# EAGLE design HUDvio (EAGLE 9.6.2)

## Sheet 1 of 3: Primary Sheet
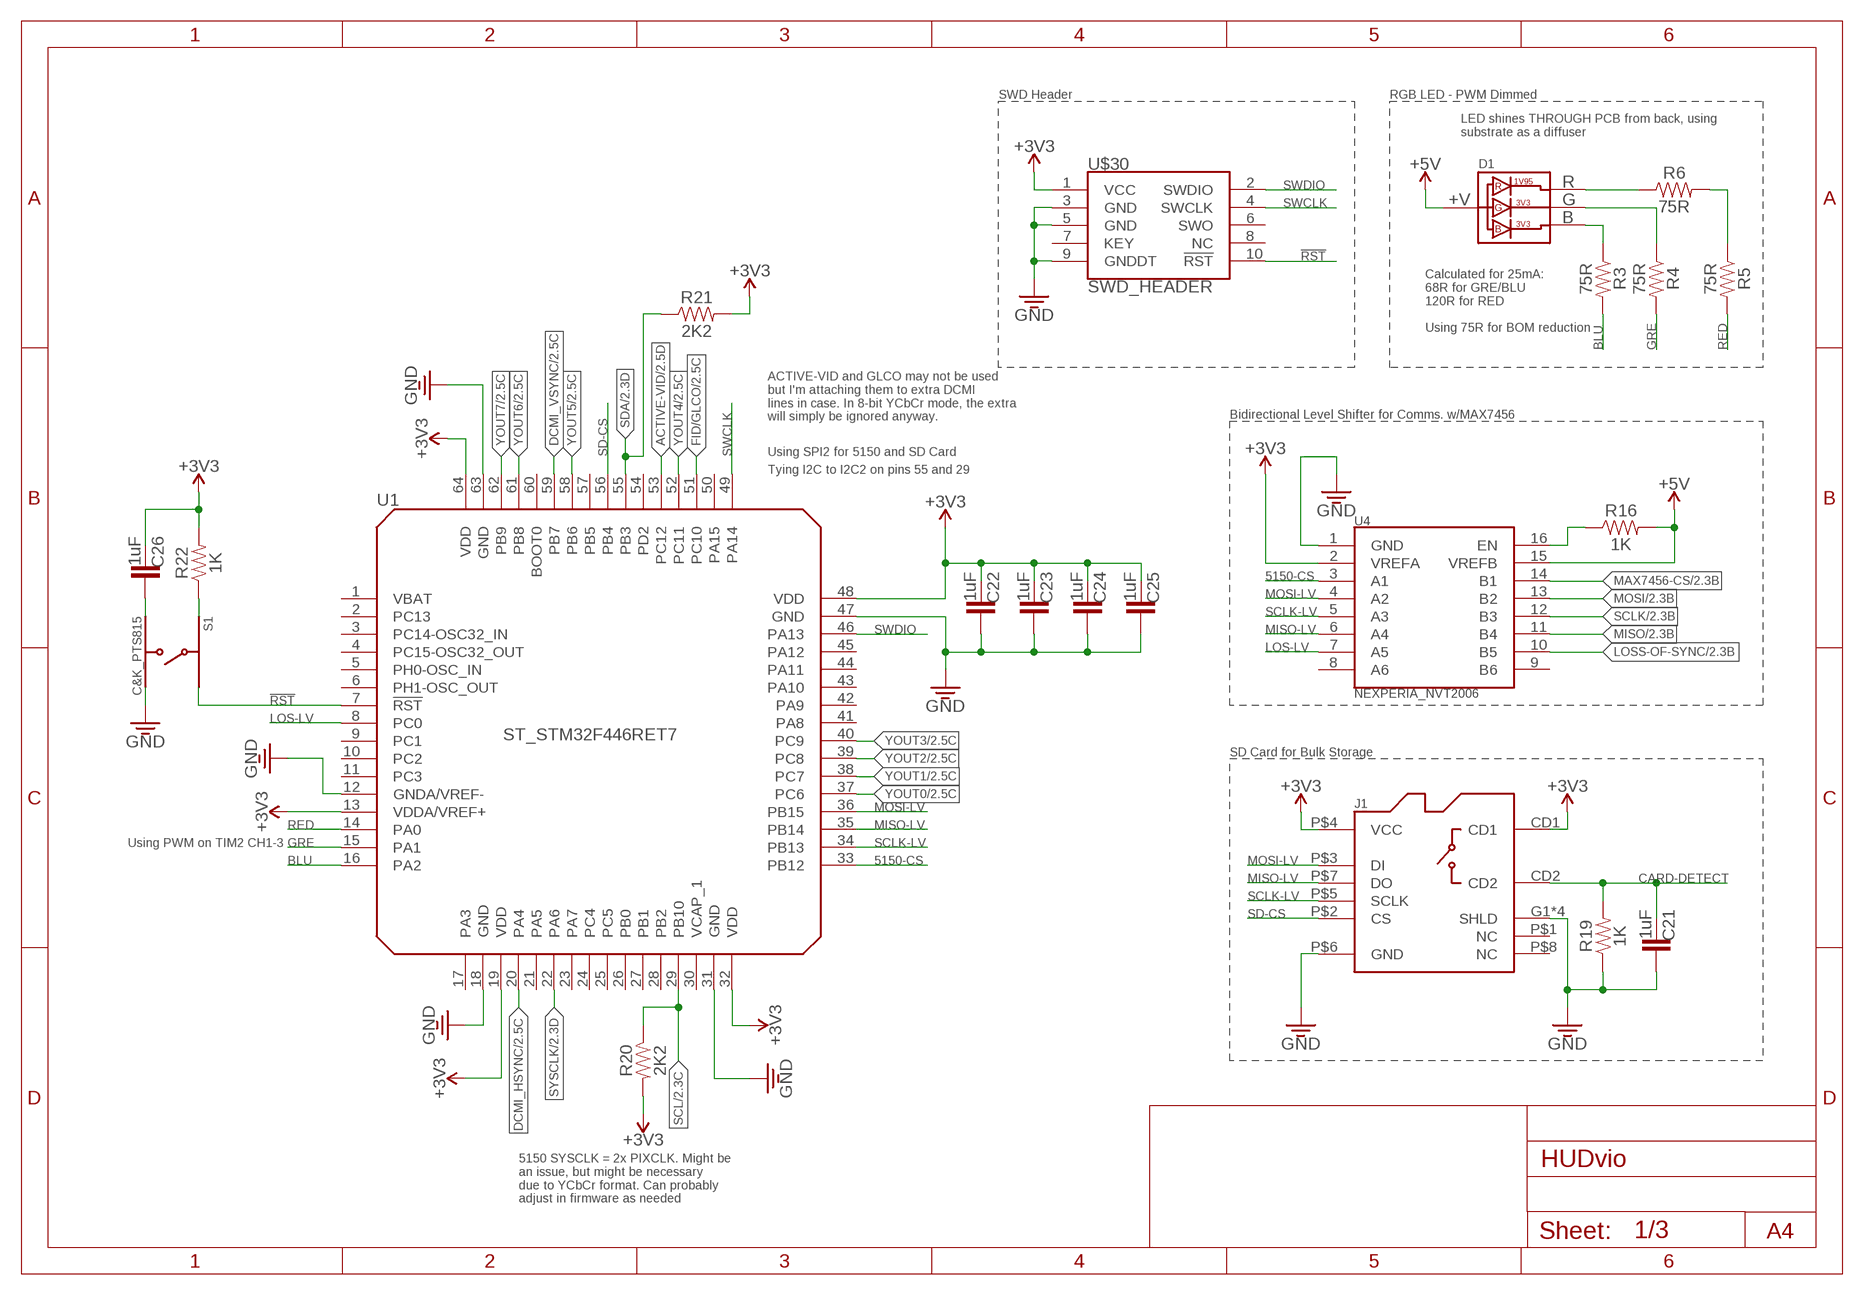
[diagram p0: schematic, sheet 1]

### Parts
C21  1UF_0805  [KEMET_0805]
C22  1UF_0805  [KEMET_0805]
C23  1UF_0805  [KEMET_0805]
C24  1UF_0805  [KEMET_0805]
C25  1UF_0805  [KEMET_0805]
C26  1UF_0805  [KEMET_0805]
D1  SUNLED_XZMDKCBDDG45S-9  [SUNLED_XZXXXXXX45S-9]
J1  MOLEX_1040310811  [MOLEX_1040310811]
R3  75R_0603  [0603]
R4  75R_0603  [0603]
R5  75R_0603  [0603]
R6  75R_0603  [0603]
R16  1K_0603  [0603]
R19  1K_0603  [0603]
R20  2K2_0603  [0603]
R21  2K2_0603  [0603]
R22  1K_0603  [0603]
S1  C&K_PTS815  [C&K_PTS815]
U1  ST_STM32F446RET7  [ST_LQFP64]
U4  NEXPERIA_NVT2006  [NEXPERIA_SOT403-1_(TSSOP16)]
U$30  SWD_HEADER  [CNC_3220-10-0300-00]

### Nets
5150-CS: U1.33(PB12) U4.3(A1)
!RST: S1.2 U1.7(!RST!) U$30.10(!RST!)
+3V3: C22.P$1 C23.P$1 C24.P$1 C25.P$1 C26.P$1 J1.CD1 J1.P$4(VCC) R20.2 R21.2 R22.2 U1.13(VDDA/VREF+) U1.19(VDD) U1.32(VDD) U1.48(VDD) U1.64(VDD) U4.2(VREFA) U$30.1(VCC) ; also sheet 2,3
+5V: D1.P$2(VCC) R16.2 U4.15(VREFB) ; also sheet 2,3
ACTIVE-VID: U1.53(PC12) ; also sheet 2
BLU: R3.2 U1.16(PA2)
CARD-DETECT: C21.P$1 J1.CD2 R19.2
DCMI_HSYNC: U1.20(PA4) ; also sheet 2
DCMI_VSYNC: U1.59(PB7) ; also sheet 2
FID/GLCO: U1.51(PC10) ; also sheet 2
GND: C21.P$2 C22.P$2 C23.P$2 C24.P$2 C25.P$2 J1.G1(SHLD) J1.G2(SHLD) J1.G3(SHLD) J1.G4(SHLD) J1.P$6(GND) R19.1 S1.4 U1.12(GNDA/VREF-) U1.18(GND) U1.31(GND) U1.47(GND) U1.63(GND) U4.1(GND) U$30.3(GND) U$30.5(GND) U$30.9(GNDDT) ; also sheet 2,3
GRE: R4.2 U1.15(PA1)
LOS-LV: U1.8(PC0) U4.7(A5)
LOSS-OF-SYNC: U4.10(B5) ; also sheet 2
MAX7456-CS: U4.14(B1) ; also sheet 2
MISO: U4.11(B4) ; also sheet 2
MISO-LV: J1.P$7(DO) U1.35(PB14) U4.6(A4)
MOSI: U4.13(B2) ; also sheet 2
MOSI-LV: J1.P$3(DI) U1.36(PB15) U4.4(A2)
N$2: D1.P$1(R) R6.1
N$3: R5.1 R6.2
N$4: D1.P$4(G) R4.1
N$5: D1.P$3(B) R3.1
N$13: R16.1 U4.16(EN)
N$17: R22.1 S1.1
N$18: C26.P$2 S1.3
RED: R5.2 U1.14(PA0)
SCL: R20.1 U1.29(PB10) ; also sheet 2
SCLK: U4.12(B3) ; also sheet 2
SCLK-LV: J1.P$5(SCLK) U1.34(PB13) U4.5(A3)
SD-CS: J1.P$2(CS) U1.56(PB4)
SDA: R21.1 U1.55(PB3) ; also sheet 2
SWCLK: U1.49(PA14) U$30.4(SWCLK)
SWDIO: U1.46(PA13) U$30.2(SWDIO)
SYSCLK: U1.22(PA6) ; also sheet 2
YOUT0: U1.37(PC6) ; also sheet 2
YOUT1: U1.38(PC7) ; also sheet 2
YOUT2: U1.39(PC8) ; also sheet 2
YOUT3: U1.40(PC9) ; also sheet 2
YOUT4: U1.52(PC11) ; also sheet 2
YOUT5: U1.58(PB6) ; also sheet 2
YOUT6: U1.61(PB8) ; also sheet 2
YOUT7: U1.62(PB9) ; also sheet 2
Unconnected: J1.P$1(NC) J1.P$8(NC) U1.2(PC13) U1.3(PC14-OSC32_IN) U1.4(PC15-OSC32_OUT) U1.5(PH0-OSC_IN) U1.6(PH1-OSC_OUT) U1.9(PC1) U1.10(PC2) U1.11(PC3) U1.17(PA3) U1.21(PA5) U1.23(PA7) U1.24(PC4) U1.25(PC5) U1.26(PB0) U1.27(PB1) U1.28(PB2) U1.41(PA8) U1.42(PA9) U1.43(PA10) U1.44(PA11) U1.45(PA12) U1.50(PA15) U1.54(PD2) U1.57(PB5) U1.60(BOOT0) U4.8(A6) U4.9(B6) U$30.6(SWO) U$30.7(KEY) U$30.8(NC)

### Notes on the sheet
- SWD Header | RGB LED - PWM Dimmed
- LED shines THROUGH PCB from back, using
  substrate as a diffuser
- Calculated for 25mA:
  68R for GRE/BLU
  120R for RED
  
  Using 75R for BOM reduction
- Bidirectional Level Shifter for Comms. w/MAX7456
- ACTIVE-VID and GLCO may not be used
  but I'm attaching them to extra DCMI
  lines in case. In 8-bit YCbCr mode, the extra
  will simply be ignored anyway.
- Using SPI2 for 5150 and SD Card
- Tying I2C to I2C2 on pins 55 and 29
- SD Card for Bulk Storage
- Using PWM on TIM2 CH1-3
- 5150 SYSCLK = 2x PIXCLK. Might be
  an issue, but might be necessary
  due to YCbCr format. Can probably 
  adjust in firmware as needed

## Sheet 2 of 3: Video Processing
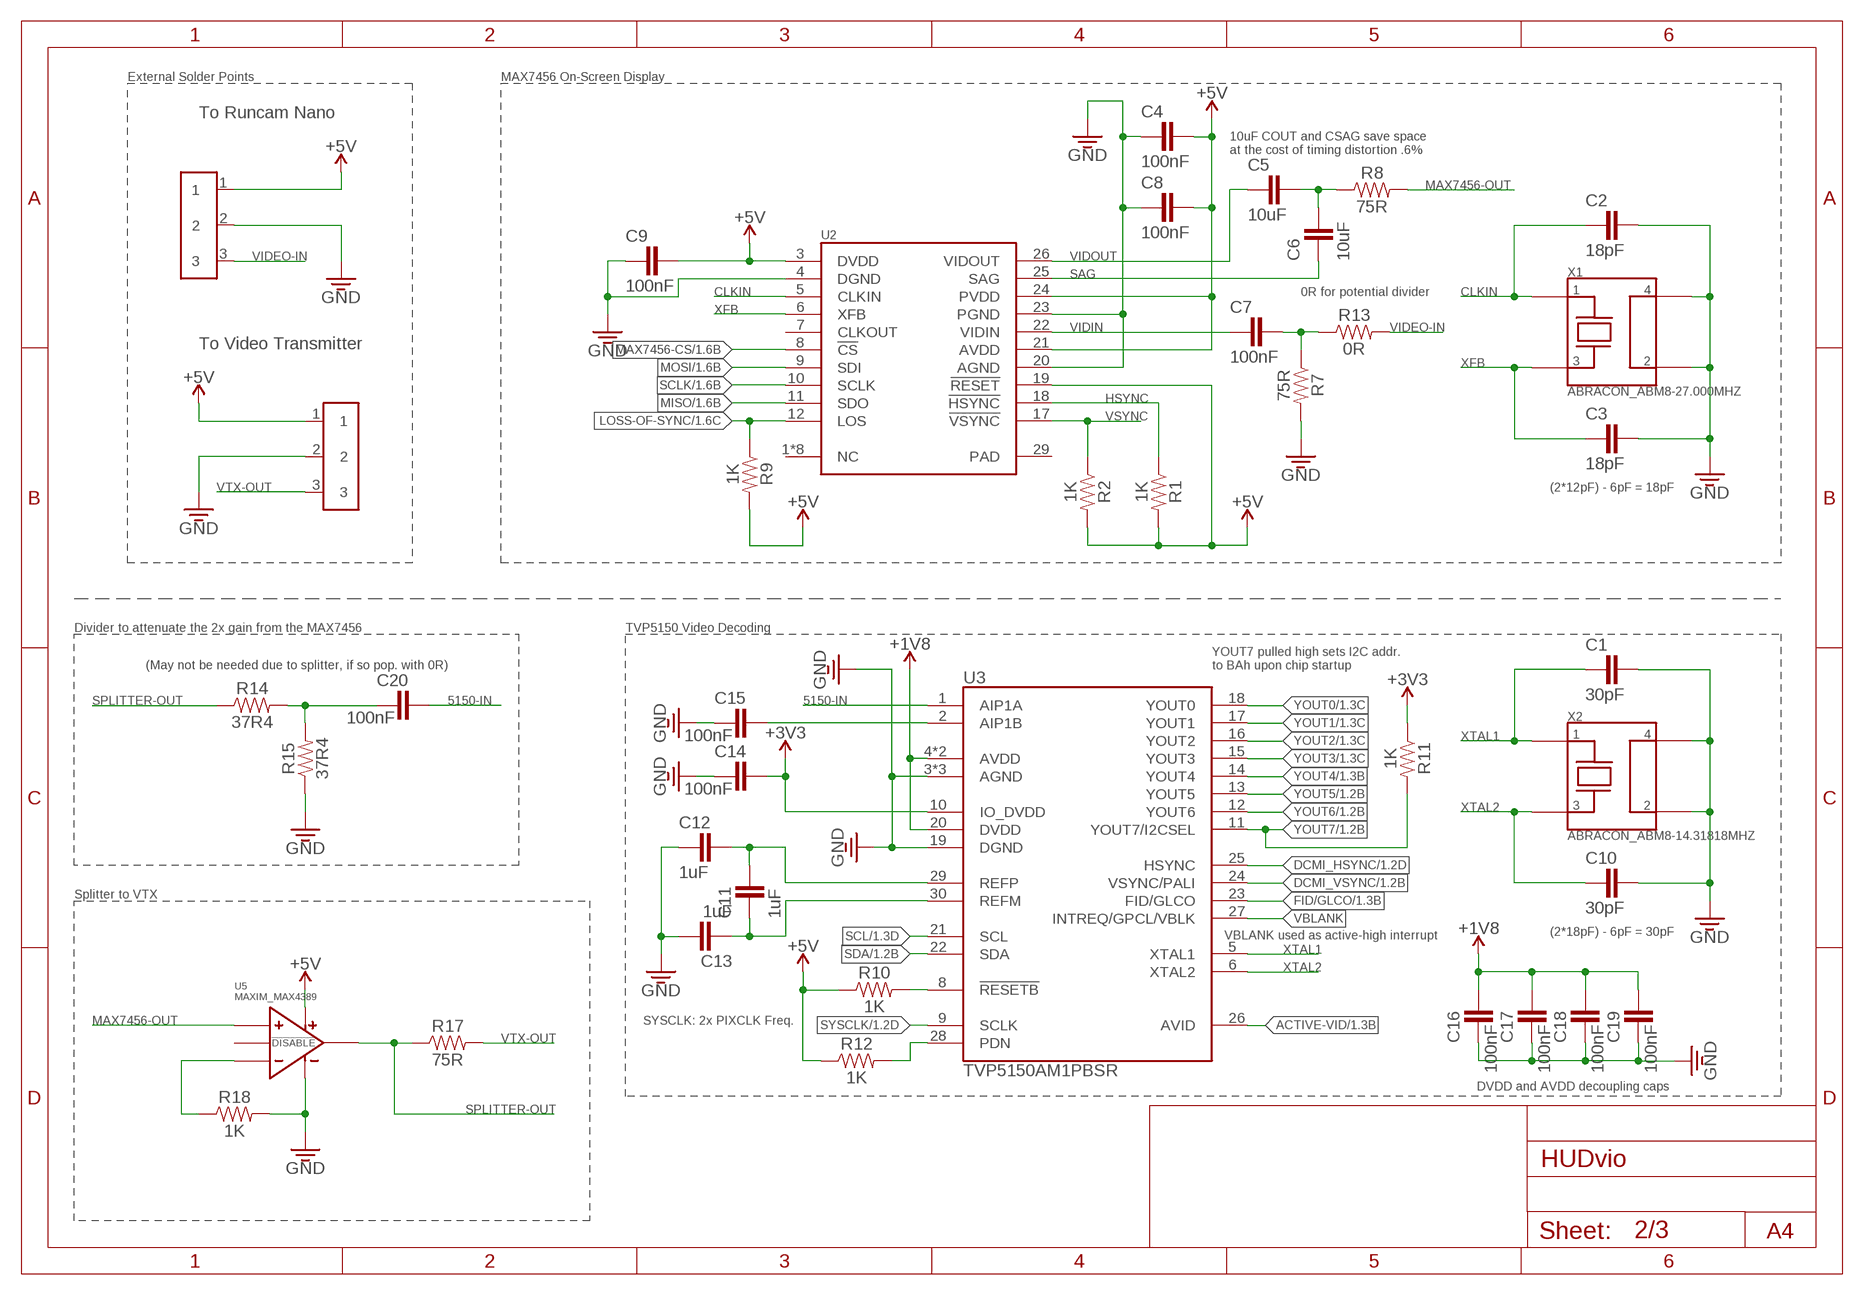
[diagram p1: schematic, sheet 2]

### Parts
C1  30PF_0805  [KEMET_0805]
C2  18PF_0805  [KEMET_0805]
C3  18PF_0805  [KEMET_0805]
C4  100NF_0805  [KEMET_0805]
C5  10UF_0805  [KEMET_0805]
C6  10UF_0805  [KEMET_0805]
C7  100NF_0805  [KEMET_0805]
C8  100NF_0805  [KEMET_0805]
C9  100NF_0805  [KEMET_0805]
C10  30PF_0805  [KEMET_0805]
C11  1UF_0805  [KEMET_0805]
C12  1UF_0805  [KEMET_0805]
C13  1UF_0805  [KEMET_0805]
C14  100NF_0805  [KEMET_0805]
C15  100NF_0805  [KEMET_0805]
C16  100NF_0805  [KEMET_0805]
C17  100NF_0805  [KEMET_0805]
C18  100NF_0805  [KEMET_0805]
C19  100NF_0805  [KEMET_0805]
C20  100NF_0805  [KEMET_0805]
R1  1K_0603  [0603]
R2  1K_0603  [0603]
R7  75R_0603  [0603]
R8  75R_0603  [0603]
R9  1K_0603  [0603]
R10  1K_0603  [0603]
R11  1K_0603  [0603]
R12  1K_0603  [0603]
R13  0R_0603  [0603]
R14  37R4_0603  [0603]
R15  37R4_0603  [0603]
R17  75R_0603  [0603]
R18  1K_0603  [0603]
U2  MAXIM_MAX7456  [MAXIM_MAX7456EUI+T]
U3  TVP5150AM1PBSR  [TI_PBS_(S-PQFP-G32)]
U5  MAXIM_MAX4389  [MAXIM_21-0058_(SOT23-6)]
U$1  SOLDER_PAD_1X3  [SOLDER_PAD_1X3_3X2MM]
U$3  SOLDER_PAD_1X3  [SOLDER_PAD_1X3_3X2MM]
X1  ABRACON_ABM8-27.000MHZ  [ABRACON_ABM8]
X2  ABRACON_ABM8-14.31818MHZ  [ABRACON_ABM8]

### Nets
5150-IN [75R]: C20.P$2 U3.1(AIP1A)
$NET11 [75R]: C7.P$2 R7.1 R13.1
+1V8: C16.P$2 C17.P$2 C18.P$2 C19.P$2 U3.4(AVDD) U3.20(DVDD) U3.32(AVDD) ; also sheet 3
+3V3: C14.P$2 R11.1 U3.10(IO_DVDD) ; also sheet 1,3
+5V: C4.P$2 C8.P$2 C9.P$2 R9.2 R10.1 R12.1 U2.3(DVDD) U2.21(AVDD) U2.24(PVDD) U5.6(VCC) U$1.1 U$3.1 ; also sheet 1,3
ACTIVE-VID: U3.26(AVID) ; also sheet 1
CLKIN: C2.P$1 U2.5(CLKIN) X1.1
DCMI_HSYNC: U3.25(HSYNC) ; also sheet 1
DCMI_VSYNC: U3.24(VSYNC/PALI) ; also sheet 1
FID/GLCO: U3.23(FID/GLCO) ; also sheet 1
GND: C1.P$2 C2.P$2 C3.P$2 C4.P$1 C8.P$1 C9.P$1 C10.P$2 C12.P$1 C13.P$2 C14.P$1 C15.P$1 C16.P$1 C17.P$1 C18.P$1 C19.P$1 R7.2 R15.1 R18.2 U2.4(DGND) U2.20(AGND) U2.23(PGND) U3.3(AGND) U3.7(AGND) U3.19(DGND) U3.31(AGND) U5.2(VEE) U$1.2 U$3.2 X1.2 X1.4 X2.2 X2.4 ; also sheet 1,3
HSYNC: R1.1 U2.18(!HSYNC!)
LOSS-OF-SYNC: R9.1 U2.12(LOS) ; also sheet 1
MAX7456-CS: U2.8(!CS!) ; also sheet 1
MAX7456-OUT [75R]: R8.2
MISO: U2.11(SDO) ; also sheet 1
MOSI: U2.9(SDI) ; also sheet 1
N$1: R1.2 R2.2 U2.19(!RESET!) ; supply symbol labelled +5V
N$6: R10.2 U3.8(!RESETB!)
N$7: R12.2 U3.28(PDN)
N$8: C11.P$1 C13.P$1 U3.30(REFM)
N$9: C11.P$2 C12.P$2 U3.29(REFP)
N$10: C5.P$2 C6.P$2 R8.1
N$11: C20.P$1 R14.2 R15.2
N$12: C15.P$2 U3.2(AIP1B)
N$14: U5.3(IN+)
N$15: R18.1 U5.4(IN-)
SAG: C6.P$1 U2.25(SAG)
SCL: U3.21(SCL) ; also sheet 1
SCLK: U2.10(SCLK) ; also sheet 1
SDA: U3.22(SDA) ; also sheet 1
SPLITTER-OUT [75R]: R14.1 R17.1 U5.1(OUT)
SYSCLK: U3.9(SCLK) ; also sheet 1
VBLANK: U3.27(INTREQ/GPCL/VBLK)
VIDEO-IN [75R]: R13.2 U$1.3
VIDIN [75R]: C7.P$1 U2.22(VIDIN)
VIDOUT [75R]: C5.P$1 U2.26(VIDOUT)
VSYNC: R2.1 U2.17(!VSYNC!)
VTX-OUT [75R]: R17.2 U$3.3
XFB: C3.P$1 U2.6(XFB) X1.3
XTAL1: C1.P$1 U3.5(XTAL1) X2.1
XTAL2: C10.P$1 U3.6(XTAL2) X2.3
YOUT0: U3.18(YOUT0) ; also sheet 1
YOUT1: U3.17(YOUT1) ; also sheet 1
YOUT2: U3.16(YOUT2) ; also sheet 1
YOUT3: U3.15(YOUT3) ; also sheet 1
YOUT4: U3.14(YOUT4) ; also sheet 1
YOUT5: U3.13(YOUT5) ; also sheet 1
YOUT6: U3.12(YOUT6) ; also sheet 1
YOUT7: R11.2 U3.11(YOUT7/I2CSEL) ; also sheet 1
Unconnected: U2.1(NC) U2.2(NC) U2.7(CLKOUT) U2.13(NC) U2.14(NC) U2.15(NC) U2.16(NC) U2.27(NC) U2.28(NC) U5.5(!DISABLE!)

### Notes on the sheet
- External Solder Points | MAX7456 On-Screen Display
- To Runcam Nano
- 10uF COUT and CSAG save space
  at the cost of timing distortion .6%
- 0R for potential divider
- To Video Transmitter
- (2*12pF) - 6pF = 18pF
- Divider to attenuate the 2x gain from the MAX7456 | TVP5150 Video Decoding
- (May not be needed due to splitter, if so pop. with 0R)
- YOUT7 pulled high sets I2C addr. 
  to BAh upon chip startup
- Splitter to VTX
- VBLANK used as active-high interrupt | (2*18pF) - 6pF = 30pF
- SYSCLK: 2x PIXCLK Freq.
- DVDD and AVDD decoupling caps

## Sheet 3 of 3: Power Regulation
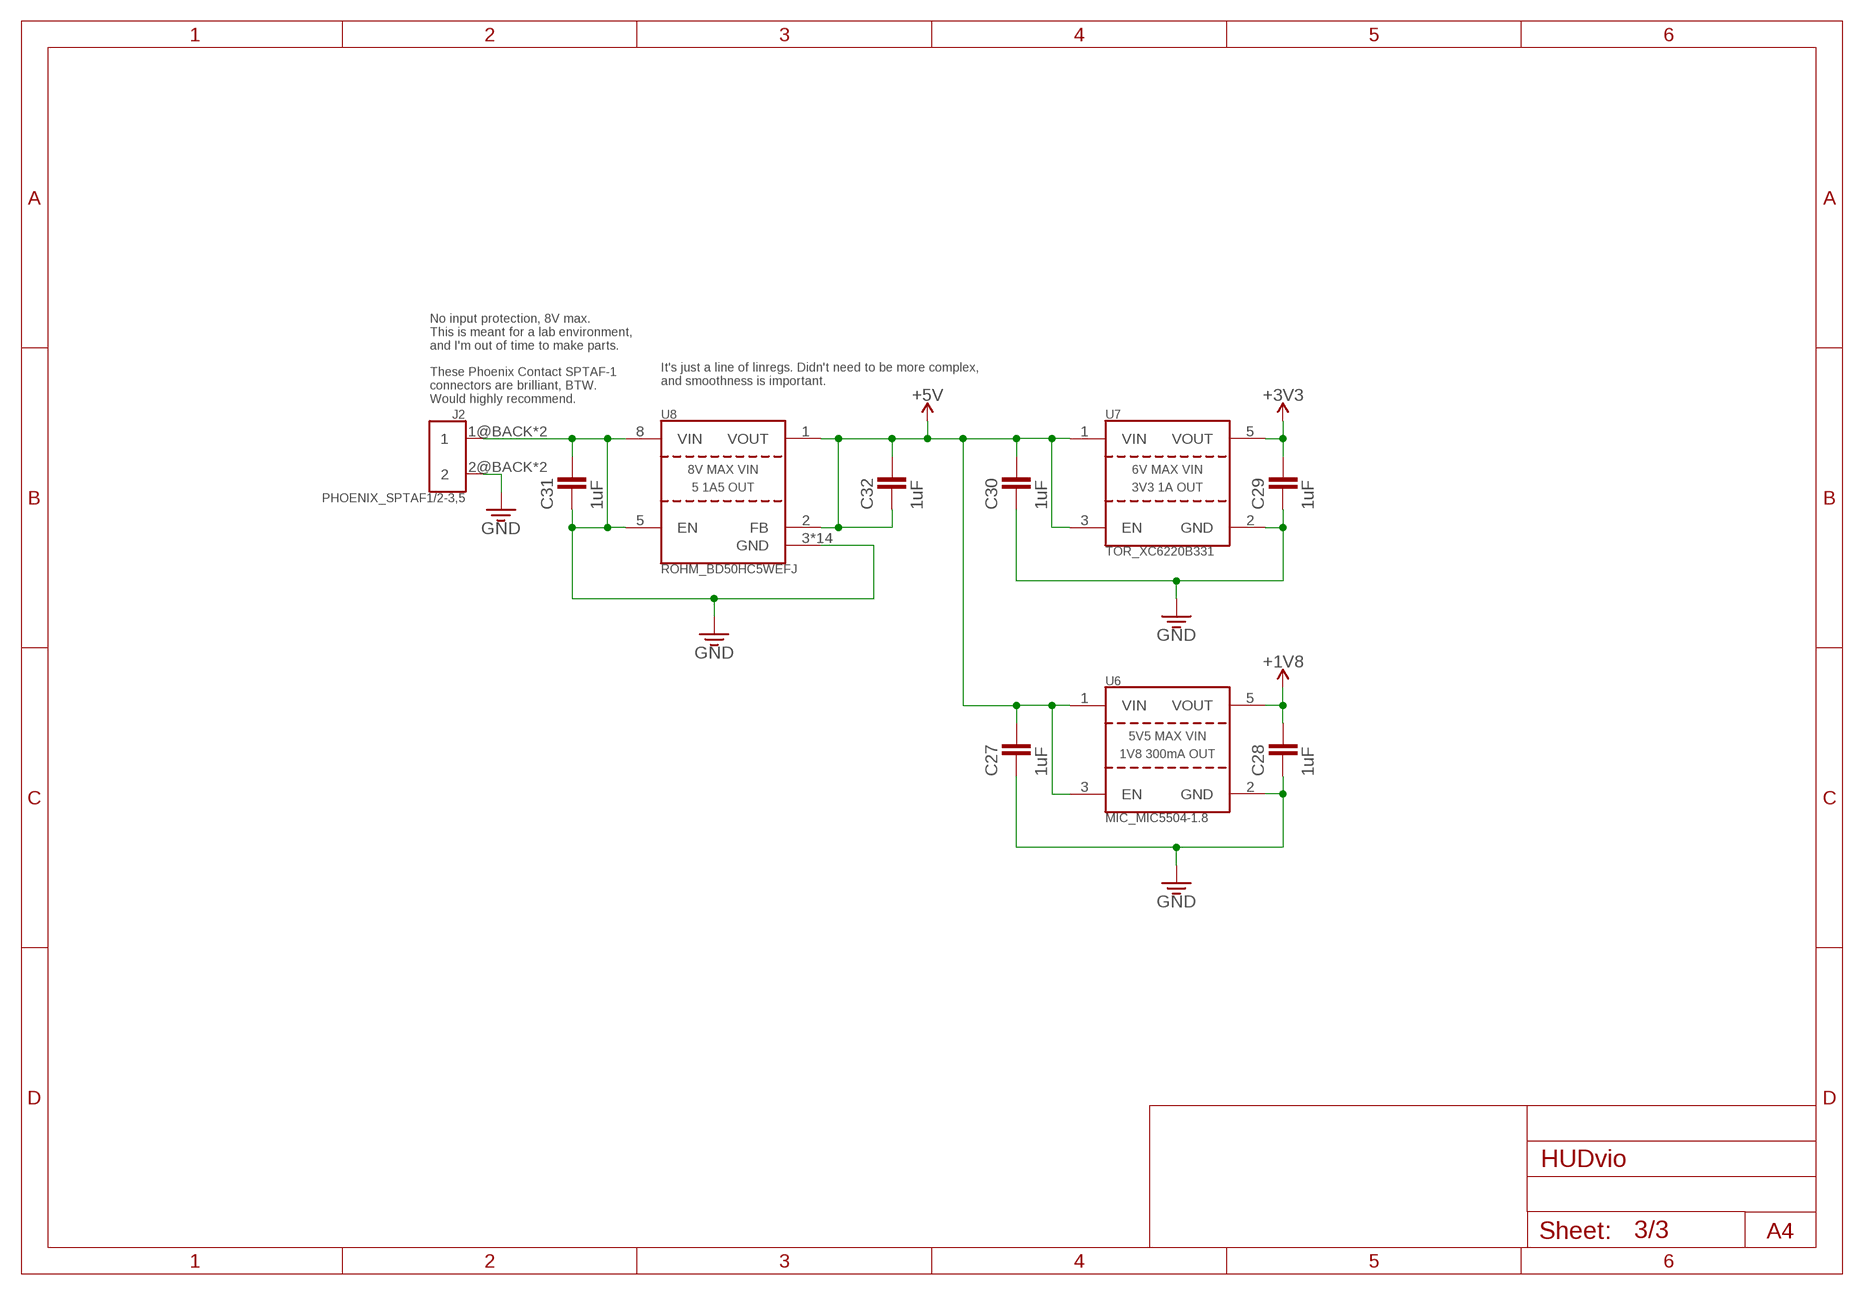
[diagram p2: schematic, sheet 3]

### Parts
C27  1UF_0805  [KEMET_0805]
C28  1UF_0805  [KEMET_0805]
C29  1UF_0805  [KEMET_0805]
C30  1UF_0805  [KEMET_0805]
C31  1UF_0805  [KEMET_0805]
C32  1UF_0805  [KEMET_0805]
J2  PHOENIX_SPTAF1/2-3,5  [PHOENIX_SPTAF1/X-3,5]
U6  MIC_MIC5504-1.8  [MIC_SOT23-5LD-PL-1]
U7  TOR_XC6220B331  [TOR_SOT-25]
U8  ROHM_BD50HC5WEFJ  [ROHM_HTSOP-J8]

### Nets
+1V8: C28.P$2 U6.5(VOUT) ; also sheet 2
+3V3: C29.P$2 U7.5(VOUT) ; also sheet 1,2
+5V: C27.P$2 C30.P$2 C32.P$1 C32.P$2 U6.1(VIN) U6.3(EN) U7.1(VIN) U7.3(EN) U8.1(VOUT) U8.2(FB) ; also sheet 1,2
GND: C27.P$1 C28.P$1 C31.P$1 C31.P$2 J2.1@BACK J2.1@FRONT J2.2@BACK J2.2@FRONT U6.2(GND) U8.3(GND) U8.5(EN) U8.8(VIN) U8.FIN10(GND) U8.FIN11(GND) U8.FIN14(GND) U8.FIN20(GND) U8.FIN21(GND) U8.FIN22(GND) U8.FIN23(GND) U8.FIN24(GND) U8.FIN30(GND) U8.FIN31(GND) U8.FIN33(GND) U8.FIN34(GND) U8.FIN(GND) ; also sheet 1,2
N$19: C29.P$1 C30.P$1 U7.2(GND) ; supply symbol labelled GND

### Notes on the sheet
- No input protection, 8V max. 
  This is meant for a lab environment, 
  and I'm out of time to make parts.
- It's just a line of linregs. Didn't need to be more complex,
  and smoothness is important.
- These Phoenix Contact SPTAF-1
  connectors are brilliant, BTW.
  Would highly recommend.

## Power pins joined to a net without a drawn wire
PAD: U2.29(PAD)
VBAT: U1.1(VBAT)
VCAP_1: U1.30(VCAP_1)

## Library data of the parts
C1 C10 = Skyhawkson-Capacitors:30PF_0805; DKPN: 399-17443-1-ND; PACKAGE: 0805; RATING: 50V; TEMP: C0G; TOL: 10%; VAL: 30pF
C2 C3 = Skyhawkson-Capacitors:18PF_0805; DKPN: 399-8030-1-ND; PACKAGE: 0805; RATING: 50V; TEMP: C0G; TOL: 10%; VAL: 18pF
C4 C7-C9 C14-C20 = Skyhawkson-Capacitors:100NF_0805; DKPN: 399-17887-1-ND; PACKAGE: 0805; RATING: 50V; TEMP: X7R; TOL: 10%; VAL: 100nF
C5 C6 = Skyhawkson-Capacitors:10UF_0805; DKPN: 1276-1096-1-ND; PACKAGE: 0805; RATING: 16V; TEMP: X5R; TOL: 10%; VAL: 10uF
C11-C13 C21-C32 = Skyhawkson-Capacitors:1UF_0805; DKPN: 399-7409-1-ND; PACKAGE: 0805; RATING: 50V; TEMP: X7R; TOL: 10%; VAL: 1uF
D1 = Skyhawkson-LEDs and Optoelectronics:SUNLED_XZMDKCBDDG45S-9: RGB 4-SMD 3V3 30mA; DKPN: 1497-1257-1-ND
J1 = Skyhawkson-Connectors:MOLEX_1040310811; DKPN: WM6357CT-ND
J2 = Skyhawkson-Connectors:PHOENIX_SPTAF1/2-3,5; DKPN: 277-12124-ND
R1 R2 R9-R12 R16 R18 R19 R22 = Skyhawkson-Resistors:1K_0603: RES SMD 75 OHM 1% 1/10W 0603; DKPN: 311-1.00KHRCT-ND; PACKAGE: 0603; POWER: .1W; TOL: 1%; VAL: 1K
R3-R8 R17 = Skyhawkson-Resistors:75R_0603: RES SMD 75 OHM 1% 1/10W 0603; DKPN: 311-75.0HRCT-ND; PACKAGE: 0603; POWER: .1W; TOL: 1%; VAL: 75R
R13 = Skyhawkson-Resistors:0R_0603: RES SMD 75 OHM 1% 1/10W 0603; DKPN: 311-0.0GRCT-ND; PACKAGE: 0603; POWER: .1W; TOL: 1%; VAL: 0R
R14 R15 = Skyhawkson-Resistors:37R4_0603: RES SMD 75 OHM 1% 1/10W 0603; DKPN: 311-37.4HRCT-ND; PACKAGE: 0603; POWER: .1W; TOL: 1%; VAL: 37R4
R20 R21 = Skyhawkson-Resistors:2K2_0603: RES SMD 75 OHM 1% 1/10W 0603; DKPN: 311-2.2KGRCT-ND; PACKAGE: 0603; POWER: .1W; TOL: 5%; VAL: 2K2
S1 = Skyhawkson-Miscellaneous:C&K_PTS815
U1 = Skyhawkson-Microcontrollers and Processors:ST_STM32F446RET7: ARM® Cortex®-M4 STM32F4 Microcontroller IC 32-Bit 180MHz 512KB (512K x 8) FLASH 64-LQFP (10x10); DKPN: 497-16775-ND
U2 = Skyhawkson-ICs:MAXIM_MAX7456: Video - IC Serial, SPI NTSC, PAL 28-TSSOP-EP Package; DKPN: (N/A) MAX7456EUI+CT-ND
U3 = Skyhawkson-ICs:TVP5150AM1PBSR; DKPN: 296-17016-1-ND
U4 = Skyhawkson-ICs:NEXPERIA_NVT2006; DKPN: 568-5296-1-ND
U5 = Skyhawkson-RF:MAXIM_MAX4389; DKPN: MAX4389EUT+TCT-ND
U6 = Skyhawkson-Power:MIC_MIC5504-1.8; DKPN: 576-4879-1-ND
U7 = Skyhawkson-Power:TOR_XC6220B331; DKPN: 893-1133-1-ND
U8 = Skyhawkson-Power:ROHM_BD50HC5WEFJ; DKPN: BD50HC5WEFJ-E2CT-ND
U$1 U$3 = Skyhawkson-Connectors:SOLDER_PAD_1X3; DKPN: N/A
U$30 = Skyhawkson-Connectors:SWD_HEADER; DKPN: 1175-1629-ND
X1 = Skyhawkson-Miscellaneous:ABRACON_ABM8-27.000MHZ; DKPN: 535-14981-1-ND
X2 = Skyhawkson-Miscellaneous:ABRACON_ABM8-14.31818MHZ; DKPN: 535-9828-1-ND

## Net classes
1 75R: width 0.144 mm, clearance 0.3 mm

## Board
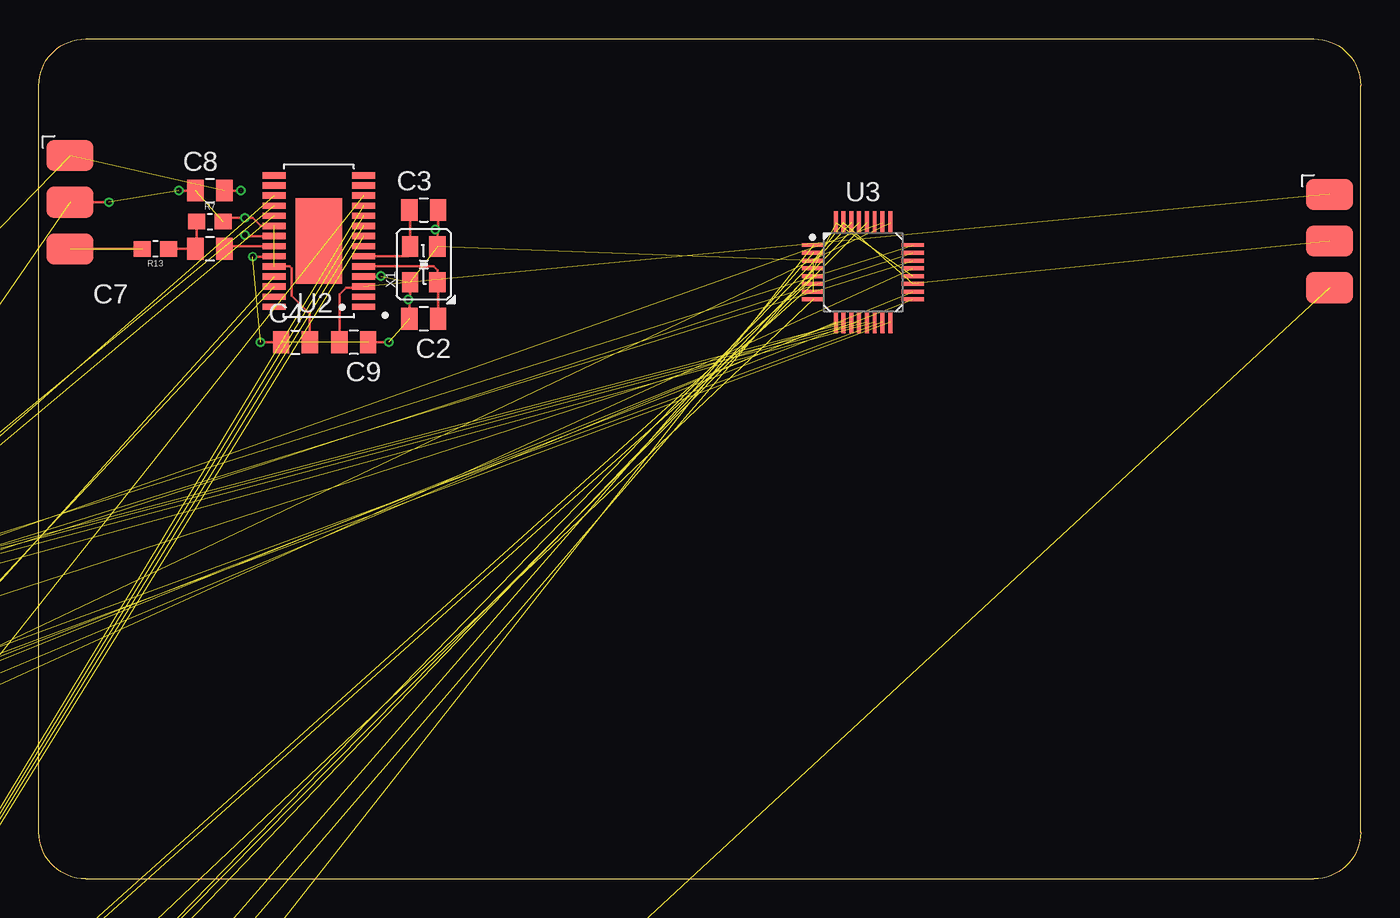
[diagram p3: board, top side]
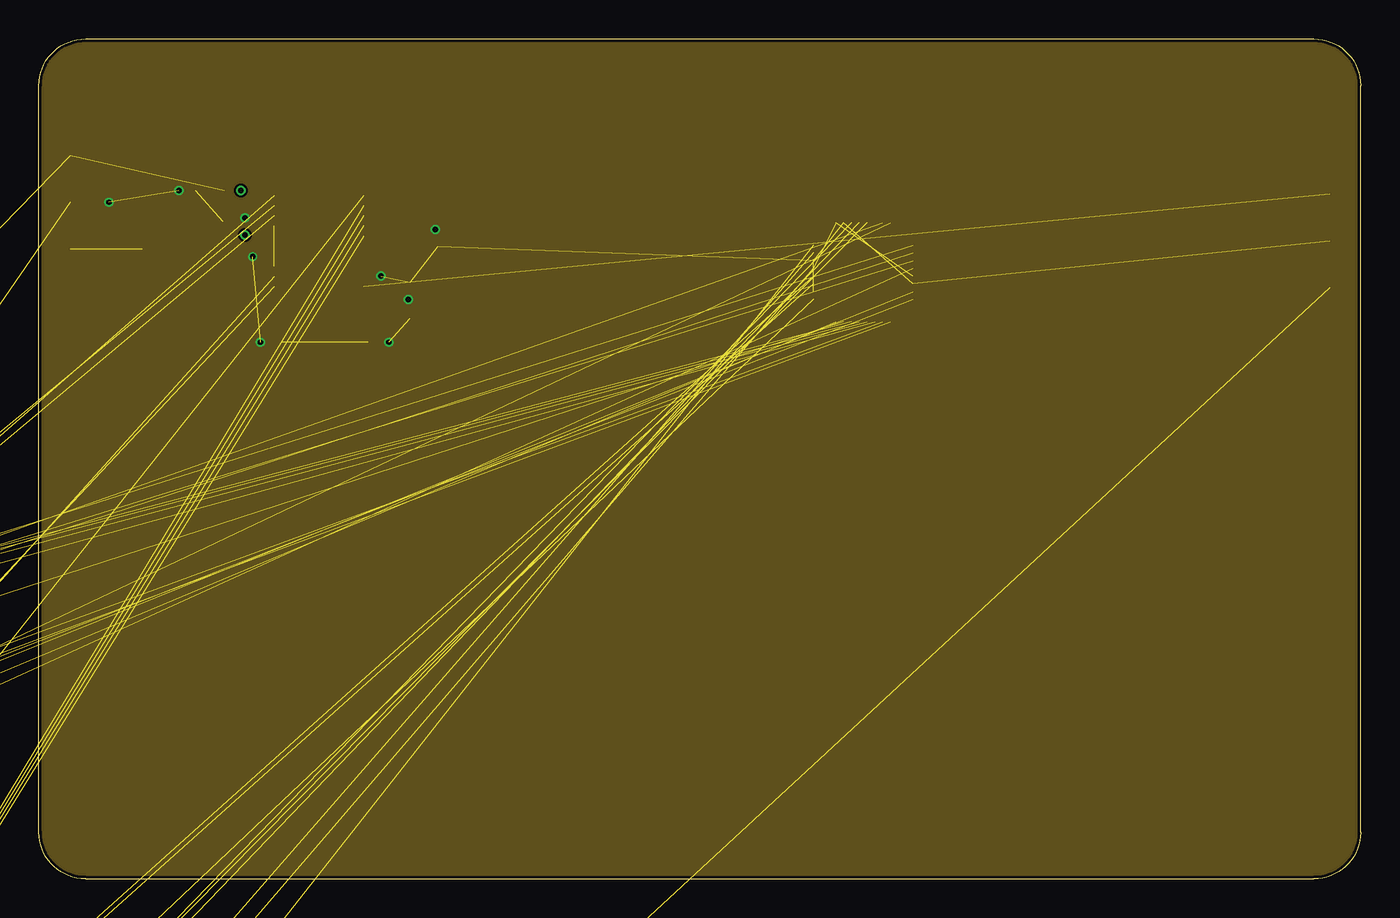
[diagram p4: board, inner layer Route2]
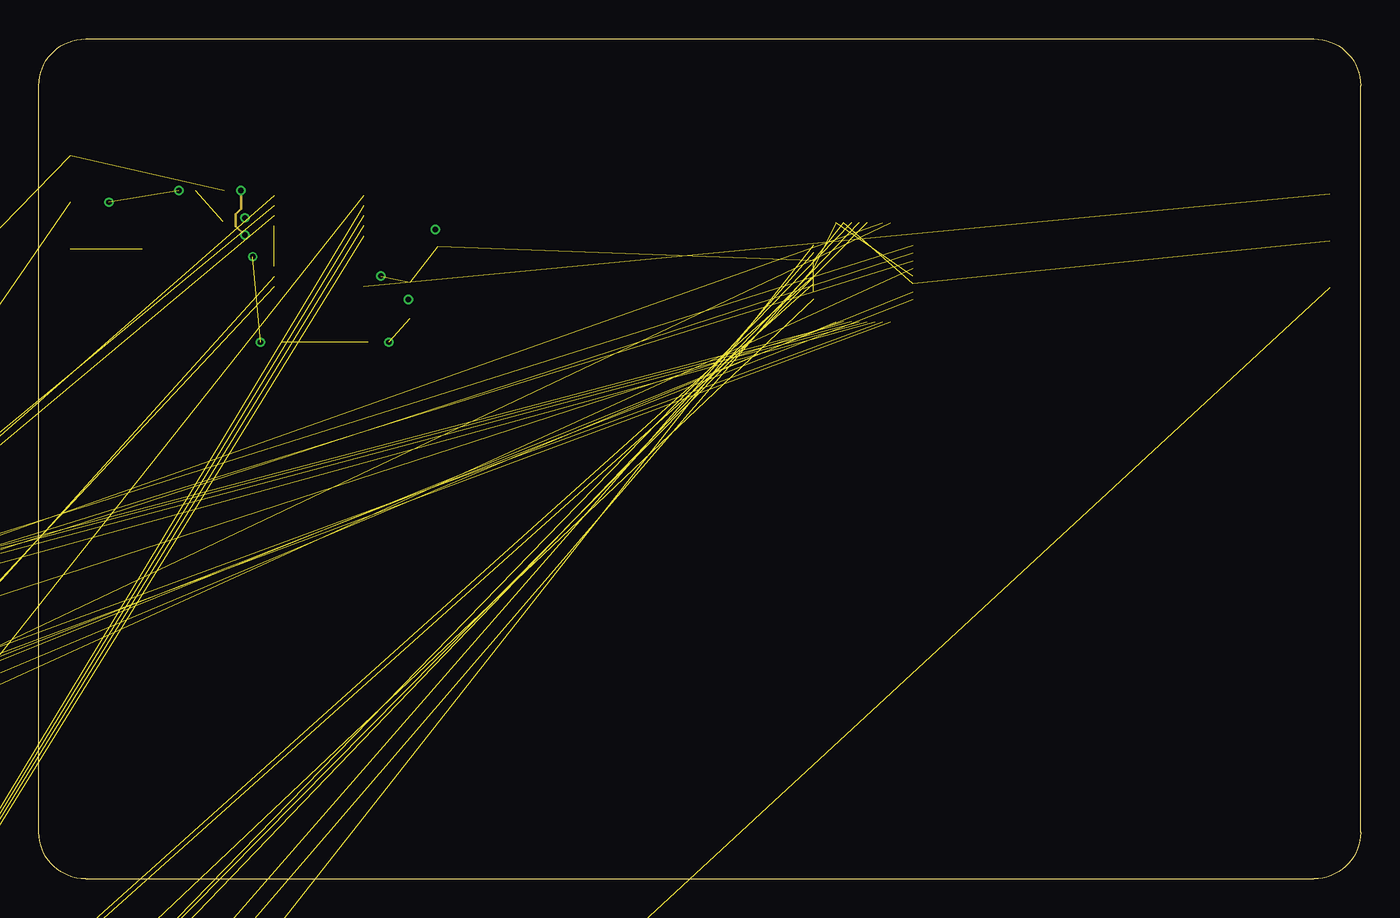
[diagram p5: board, inner layer Route15]

Size 85 x 54 mm. Coordinates in mm from the lower left corner, seen from the top.
Outline: 0,3 0,51 arc-90 3,54 82,54 arc-90 85,51 85,3 arc-90 82,0 3,0 arc-90 0,3
Copper layers (1+2*15+16): Top 0.035mm / dielectric 0.2mm / Route2 0.0175mm / dielectric 1.065mm / Route15 0.0175mm / dielectric 0.2mm / Bottom 0.035mm
Design rules "JLCPCB (4 Layer)": minimum track width 5mil, minimum drill 0.2mm, track to track 5mil, track to pad 5mil, pad to pad 5mil, via to via 20mil, smd to smd 5mil, copper to edge 0.2mm, drill to drill 21mil, minimum pad ring 6mil, minimum via ring 5mil, stop-mask expansion 2mil, vias tented up to drill 30mil, thermal gap 10mil

### Footprints (pad centres in the part's own frame; a part is rotated, then mirrored left to right if it is on the bottom)
KEMET_0805 = smd 1.05 x 1.4: P$1 -0.925,0; P$2 0.925,0
SUNLED_XZXXXXXX45S-9 = smd 1.4 x 0.8: P$1 2.6,0.8; P$2 -2.6,0.8; P$3 -2.6,-0.8; P$4 2.6,-0.8
MOLEX_1040310811 = smd 1.2 x 1: CD1 5.74,10.1; CD2 5.74,6.4 | smd 1.55 x 1.35: G1 5.565,0.425 | smd 0.9 x 1.8: G2 -5.755,0.65 | smd 1.9 x 1.35: G3 -3.73,11.075; G4 2.24,11.075 | smd 0.75 x 1.1: P$1 3.105,0.25; P$2 2.005,0.25; P$3 0.905,0.25; P$4 -0.195,0.25; P$5 -1.295,0.25; P$6 -2.395,0.25; P$7 -3.495,0.25; P$8 -4.595,0.25
PHOENIX_SPTAF1/X-3,5 = drill 1.1 pad 1.7: 1@BACK -1.75,2.5; 1@FRONT -1.75,-2.5; 2@BACK 1.75,2.5; 2@FRONT 1.75,-2.5
0603 = smd 1.1 x 1: 1 -0.85,0; 2 0.85,0
C&K_PTS815 = smd 1 x 0.7: 1 -2.25,1.075; 2 2.25,1.075; 3 -2.25,-1.075; 4 2.25,-1.075
ST_LQFP64 = smd 1.2 x 0.3: 1 -5.75,3.75; 2 -5.75,3.25; 3 -5.75,2.75; 4 -5.75,2.25; 5 -5.75,1.75; 6 -5.75,1.25; 7 -5.75,0.75; 8 -5.75,0.25; 9 -5.75,-0.25; 10 -5.75,-0.75; 11 -5.75,-1.25; 12 -5.75,-1.75; 13 -5.75,-2.25; 14 -5.75,-2.75; 15 -5.75,-3.25; 16 -5.75,-3.75; 33 5.75,-3.75; 34 5.75,-3.25; 35 5.75,-2.75; 36 5.75,-2.25; 37 5.75,-1.75; 38 5.75,-1.25; 39 5.75,-0.75; 40 5.75,-0.25; 41 5.75,0.25; 42 5.75,0.75; 43 5.75,1.25; 44 5.75,1.75; 45 5.75,2.25; 46 5.75,2.75; 47 5.75,3.25; 48 5.75,3.75 | smd 0.3 x 1.2: 17 -3.75,-5.75; 18 -3.25,-5.75; 19 -2.75,-5.75; 20 -2.25,-5.75; 21 -1.75,-5.75; 22 -1.25,-5.75; 23 -0.75,-5.75; 24 -0.25,-5.75; 25 0.25,-5.75; 26 0.75,-5.75; 27 1.25,-5.75; 28 1.75,-5.75; 29 2.25,-5.75; 30 2.75,-5.75; 31 3.25,-5.75; 32 3.75,-5.75; 49 3.75,5.75; 50 3.25,5.75; 51 2.75,5.75; 52 2.25,5.75; 53 1.75,5.75; 54 1.25,5.75; 55 0.75,5.75; 56 0.25,5.75; 57 -0.25,5.75; 58 -0.75,5.75; 59 -1.25,5.75; 60 -1.75,5.75; 61 -2.25,5.75; 62 -2.75,5.75; 63 -3.25,5.75; 64 -3.75,5.75
MAXIM_MAX7456EUI+T = smd 1.477 x 0.407: 1 -2.873,4.225; 2 -2.873,3.575; 3 -2.873,2.925; 4 -2.873,2.275; 5 -2.873,1.625; 6 -2.873,0.975; 7 -2.873,0.325; 8 -2.873,-0.325; 9 -2.873,-0.975; 10 -2.873,-1.625; 11 -2.873,-2.275; 12 -2.873,-2.925; 13 -2.873,-3.575; 14 -2.873,-4.225; 15 2.873,-4.225; 16 2.873,-3.575; 17 2.873,-2.925; 18 2.873,-2.275; 19 2.873,-1.625; 20 2.873,-0.975; 21 2.873,-0.325; 22 2.873,0.325; 23 2.873,0.975; 24 2.873,1.625; 25 2.873,2.275; 26 2.873,2.925; 27 2.873,3.575; 28 2.873,4.225 | smd 3 x 5.5: 29 0,0
TI_PBS_(S-PQFP-G32) = smd 1.438 x 0.257: 1 -3.195,1.75; 2 -3.195,1.25; 3 -3.195,0.75; 4 -3.195,0.25; 5 -3.195,-0.25; 6 -3.195,-0.75; 7 -3.195,-1.25; 8 -3.195,-1.75; 17 3.195,-1.75; 18 3.195,-1.25; 19 3.195,-0.75; 20 3.195,-0.25; 21 3.195,0.25; 22 3.195,0.75; 23 3.195,1.25; 24 3.195,1.75 | smd 0.257 x 1.438: 9 -1.75,-3.195; 10 -1.25,-3.195; 11 -0.75,-3.195; 12 -0.25,-3.195; 13 0.25,-3.195; 14 0.75,-3.195; 15 1.25,-3.195; 16 1.75,-3.195; 25 1.75,3.195; 26 1.25,3.195; 27 0.75,3.195; 28 0.25,3.195; 29 -0.25,3.195; 30 -0.75,3.195; 31 -1.25,3.195; 32 -1.75,3.195
NEXPERIA_SOT403-1_(TSSOP16) = smd 1.572 x 0.407: 1 -2.872,2.275; 2 -2.872,1.625; 3 -2.872,0.975; 4 -2.872,0.325; 5 -2.872,-0.325; 6 -2.872,-0.975; 7 -2.872,-1.625; 8 -2.872,-2.275; 9 2.872,-2.275; 10 2.872,-1.625; 11 2.872,-0.975; 12 2.872,-0.325; 13 2.872,0.325; 14 2.872,0.975; 15 2.872,1.625; 16 2.872,2.275
MAXIM_21-0058_(SOT23-6) = smd 1.222 x 0.597: 1 -1.247,0.95; 2 -1.247,0; 3 -1.247,-0.95; 4 1.247,-0.95; 5 1.247,0; 6 1.247,0.95
MIC_SOT23-5LD-PL-1 = smd 1.166 x 0.584: 1 -1.275,0.95; 2 -1.275,0; 3 -1.275,-0.95; 4 1.275,-0.95; 5 1.275,0.95
TOR_SOT-25 = smd 1.171 x 0.609: 1 -1.272,0.95; 2 -1.272,0; 3 -1.272,-0.95; 4 1.272,-0.95; 5 1.272,0.95
ROHM_HTSOP-J8 = smd 1.35 x 0.75: 1 -2.625,1.905; 2 -2.625,0.635; 3 -2.625,-0.635; 4 -2.625,-1.905; 5 2.625,-1.905; 6 2.625,-0.635; 7 2.625,0.635; 8 2.625,1.905 | smd 3.2 x 4.9: FIN 0,0 | drill 0.3 pad 0.406: FIN10 -1.2,-1.8; FIN11 -1.2,-0.6; FIN14 -1.2,1.8; FIN20 0,-1.8; FIN21 0,-0.6; FIN22 -1.2,0.6; FIN23 0,0.6; FIN24 0,1.8; FIN30 1.2,-1.8; FIN31 1.2,-0.6; FIN33 1.2,0.6; FIN34 1.2,1.8
SOLDER_PAD_1X3_3X2MM = smd 3 x 2: 1 0,3; 2 0,0; 3 0,-3
CNC_3220-10-0300-00 = smd 0.65 x 2.77: 1 -2.54,-2.015; 2 -2.54,2.015; 3 -1.27,-2.015; 4 -1.27,2.015; 5 0,-2.015; 6 0,2.015; 7 1.27,-2.015; 8 1.27,2.015; 9 2.54,-2.015; 10 2.54,2.015
ABRACON_ABM8 = smd 1.3 x 1.05: 1 -1.15,-0.875; 2 1.15,-0.875; 3 1.15,0.875; 4 -1.15,0.875

### Placement (x,y rotation side)
C1  -76,-79 0 top  (outside the outline)
C2  24.75,36 180 top
C3  24.75,43 0 top
C4  16.5,34.5 0 top
C5  -71,-55 0 top  (outside the outline)
C6  -71,-58 0 top  (outside the outline)
C7  11,40.5 180 top
C8  11,44.25 0 top
C9  20.25,34.5 180 top
C10  -76,-82 0 top  (outside the outline)
C11  -76,-91 0 top  (outside the outline)
C12  -76,-94 0 top  (outside the outline)
C13  -76,-97 0 top  (outside the outline)
C14  -76,-100 0 top  (outside the outline)
C15  -76,-103 0 top  (outside the outline)
C16  -76,-106 0 top  (outside the outline)
C17  -76,-109 0 top  (outside the outline)
C18  -76,-112 0 top  (outside the outline)
C19  -76,-115 0 top  (outside the outline)
C20  -76,-118 0 top  (outside the outline)
C21  -112,-124 270 top  (outside the outline)
C22  -117,-151 0 top  (outside the outline)
C23  -117,-154 0 top  (outside the outline)
C24  -117,-157 0 top  (outside the outline)
C25  -117,-160 0 top  (outside the outline)
C26  -117,-174 0 top  (outside the outline)
C27  -129,-177 0 top  (outside the outline)
C28  -129,-180 0 top  (outside the outline)
C29  -141,-183 0 top  (outside the outline)
C30  -141,-186 0 top  (outside the outline)
C31  -165,-189 0 top  (outside the outline)
C32  -165,-192 0 top  (outside the outline)
D1  -69,-30 0 top  (outside the outline)
J1  -125,-129 0 top  (outside the outline)
J2  -157,-179 0 top  (outside the outline)
R1  -57,-17 0 top  (outside the outline)
R2  -57,-20 0 top  (outside the outline)
R3  -71,-34 0 top  (outside the outline)
R4  -71,-37 0 top  (outside the outline)
R5  -71,-40 0 top  (outside the outline)
R6  -71,-43 0 top  (outside the outline)
R7  11,42.25 0 top
R8  -71,-52 0 top  (outside the outline)
R9  -71,-73 0 top  (outside the outline)
R10  -71,-76 0 top  (outside the outline)
R11  -76,-85 0 top  (outside the outline)
R12  -76,-88 0 top  (outside the outline)
R13  7.5,40.5 180 top
R14  -76,-124 0 top  (outside the outline)
R15  -76,-127 0 top  (outside the outline)
R16  -90,-130 0 top  (outside the outline)
R17  -103,-133 0 top  (outside the outline)
R18  -103,-136 0 top  (outside the outline)
R19  -116,-124 90 top  (outside the outline)
R20  -117,-145 0 top  (outside the outline)
R21  -117,-148 0 top  (outside the outline)
R22  -117,-171 0 top  (outside the outline)
S1  -115,-165 0 top  (outside the outline)
U1  -25.4,8.89 0 top  (outside the outline)
U2  18,41 180 top
U3  53,39 0 top
U4  -83,-123 0 top  (outside the outline)
U5  -97,-127 0 top  (outside the outline)
U6  -123,-171 0 top  (outside the outline)
U7  -135,-177 0 top  (outside the outline)
U8  -148,-182 0 top  (outside the outline)
U$1  2,43.5 0 top
U$3  83,41 0 top
U$30  -160,-199 0 top  (outside the outline)
X1  24.75,39.5 90 top
X2  -76,-74 0 top  (outside the outline)

### Tracks (layer width: path | path; a pad name or v marks a point on that pad's centre or on a via)
5150-CS  (1 unrouted)
5150-IN  (1 unrouted)
!RST  (2 unrouted)
$NET11
  Top 0.152: R7.1 10.15,40.58 C7.P$2 R13.1
+1V8  (8 unrouted)
+3V3  (21 unrouted)
+5V  (via drill 0.35)  (21 unrouted)
  Top 0.152: U2.3 20.8,38 19.75,38 19.32,37.58 C9.P$2 | U2.24 16.12,39.38 16.25,39.25 16.25,37.5 17.43,36.33 C4.P$2 | U2.21 13.31,41.33 v13.25,41.39 | v13,44.25 C8.P$2
  Route15 0.152: v13,44.25 13,43.07 12.67,42.74 12.67,41.97 v13.25,41.39
ACTIVE-VID  (1 unrouted)
BLU  (1 unrouted)
CARD-DETECT  (2 unrouted)
CLKIN
  Top 0.152: U2.5 25.38,39.38 25.62,39.12 X1.1 25.68,38.3 C2.P$1
DCMI_HSYNC  (1 unrouted)
DCMI_VSYNC  (1 unrouted)
FID/GLCO  (1 unrouted)
GND  (via drill 0.35)  (74 unrouted)
  Top 0.152: U$1.2 v4.5,43.5 | R7.2 12.1,42.5 v13.25,42.5 13.75,42.5 14.28,41.98 U2.20 | U2.23 15.1,40 v13.75,40 | U2.4 21.98,38.73 v22,38.75 | X1.4 23.88,37.38 v23.75,37.25 23.82,37.17 C2.P$2 | X1.2 25.62,41.62 v25.5,41.75 25.68,41.92 C3.P$2 | C9.P$1 v22.5,34.5 | C4.P$1 v14.25,34.5 | C8.P$1 v9,44.25
  pour Route2: 0,54 85,54 85,0 0,0
GRE  (1 unrouted)
HSYNC  (1 unrouted)
LOS-LV  (1 unrouted)
LOSS-OF-SYNC  (2 unrouted)
MAX7456-CS  (1 unrouted)
MISO  (1 unrouted)
MISO-LV  (2 unrouted)
MOSI  (1 unrouted)
MOSI-LV  (2 unrouted)
N$1  (2 unrouted)
N$2  (1 unrouted)
N$3  (1 unrouted)
N$4  (1 unrouted)
N$5  (1 unrouted)
N$6  (1 unrouted)
N$7  (1 unrouted)
N$8  (2 unrouted)
N$9  (2 unrouted)
N$10  (2 unrouted)
N$11  (2 unrouted)
N$12  (1 unrouted)
N$13  (1 unrouted)
N$15  (1 unrouted)
N$17  (1 unrouted)
N$18  (1 unrouted)
N$19  (2 unrouted)
RED  (1 unrouted)
SAG  (1 unrouted)
SCL  (2 unrouted)
SCLK  (1 unrouted)
SCLK-LV  (2 unrouted)
SD-CS  (1 unrouted)
SDA  (2 unrouted)
SPLITTER-OUT  (2 unrouted)
SWCLK  (1 unrouted)
SWDIO  (1 unrouted)
SYSCLK  (1 unrouted)
VIDEO-IN  (1 unrouted)
  Top 0.152: U$1.3 R13.2
VIDIN
  Top 0.152: U2.22 12.1,40.67 C7.P$1
VIDOUT  (1 unrouted)
VSYNC  (1 unrouted)
VTX-OUT  (1 unrouted)
XFB
  Top 0.152: U2.6 23.75,40.02 23.88,40.15 X1.3 23.88,42.95 C3.P$1
XTAL1  (2 unrouted)
XTAL2  (2 unrouted)
YOUT0  (1 unrouted)
YOUT1  (1 unrouted)
YOUT2  (1 unrouted)
YOUT3  (1 unrouted)
YOUT4  (1 unrouted)
YOUT5  (1 unrouted)
YOUT6  (1 unrouted)
YOUT7  (2 unrouted)

### Text on the board
Document: Board designed around 1.6mm JLC7628 Stackup